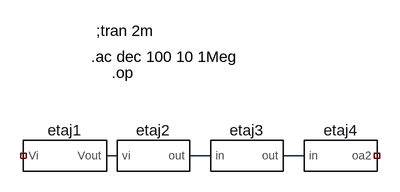
[diagram p0: schematic proiect.asc]
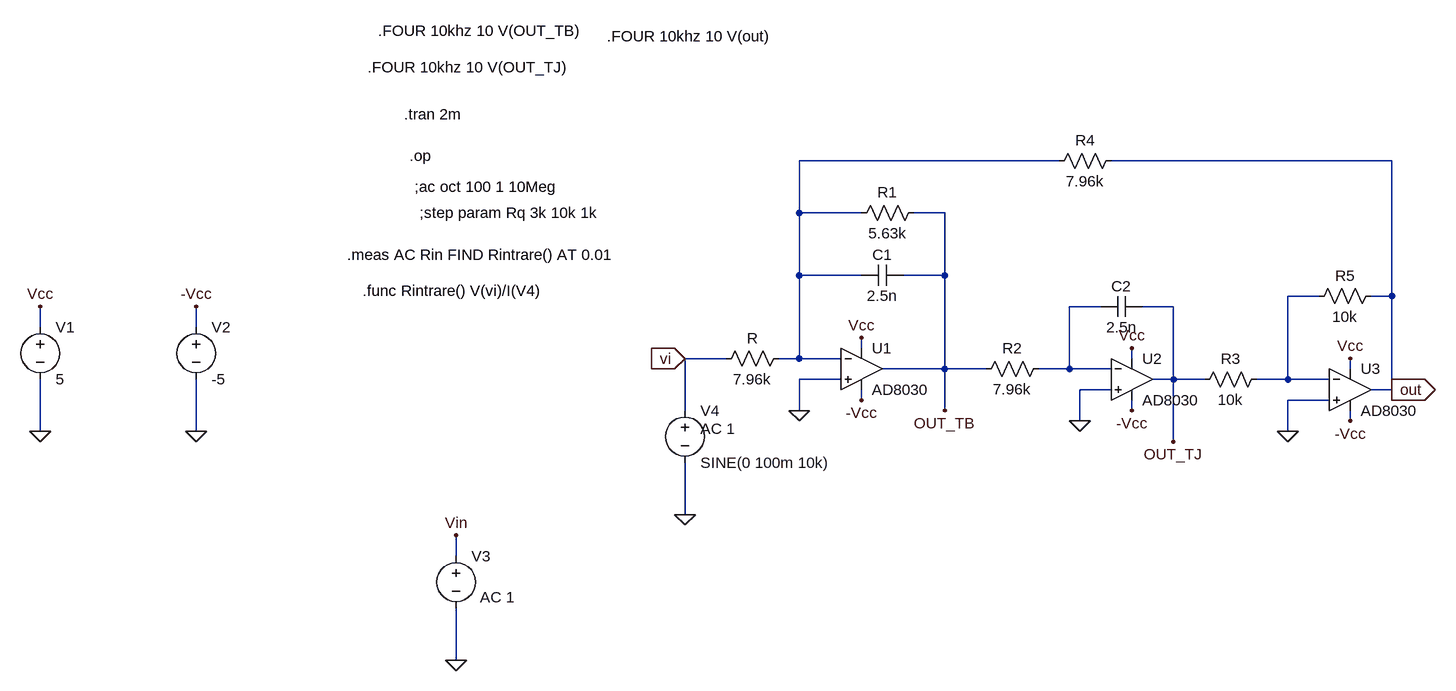
[diagram p1: sub-circuit etaj2_.asc]
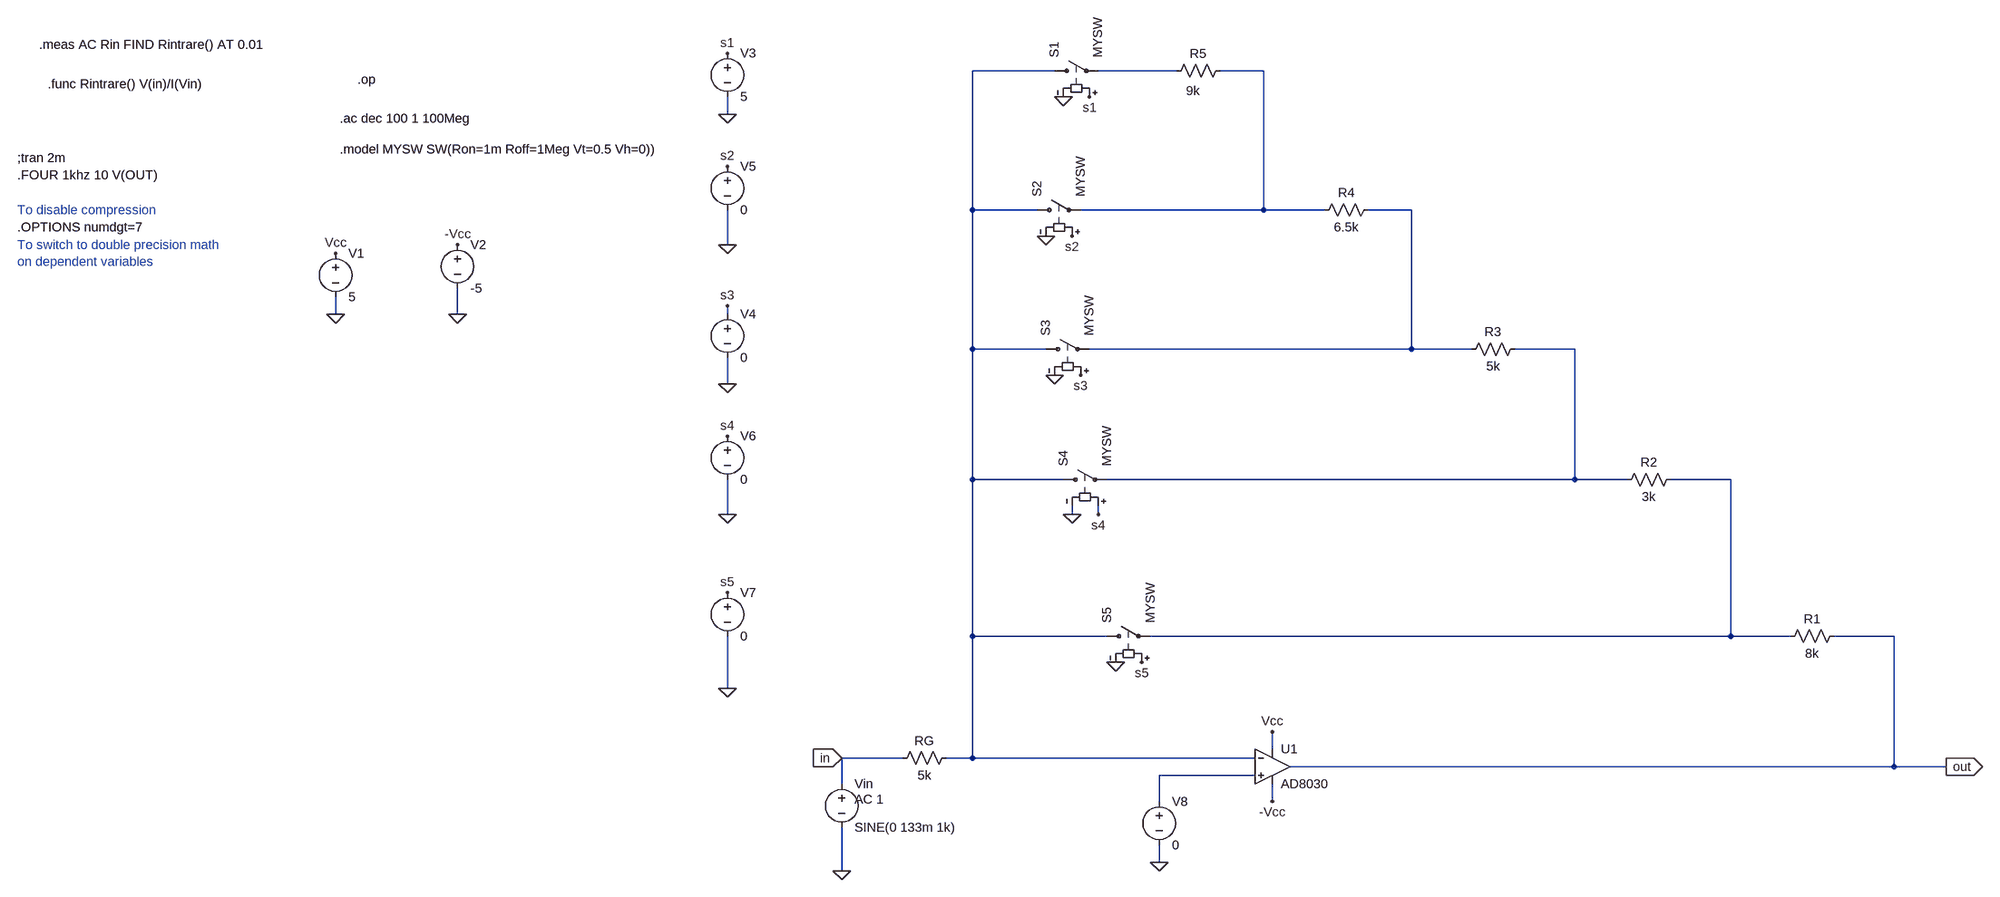
[diagram p2: sub-circuit etaj3_.asc]
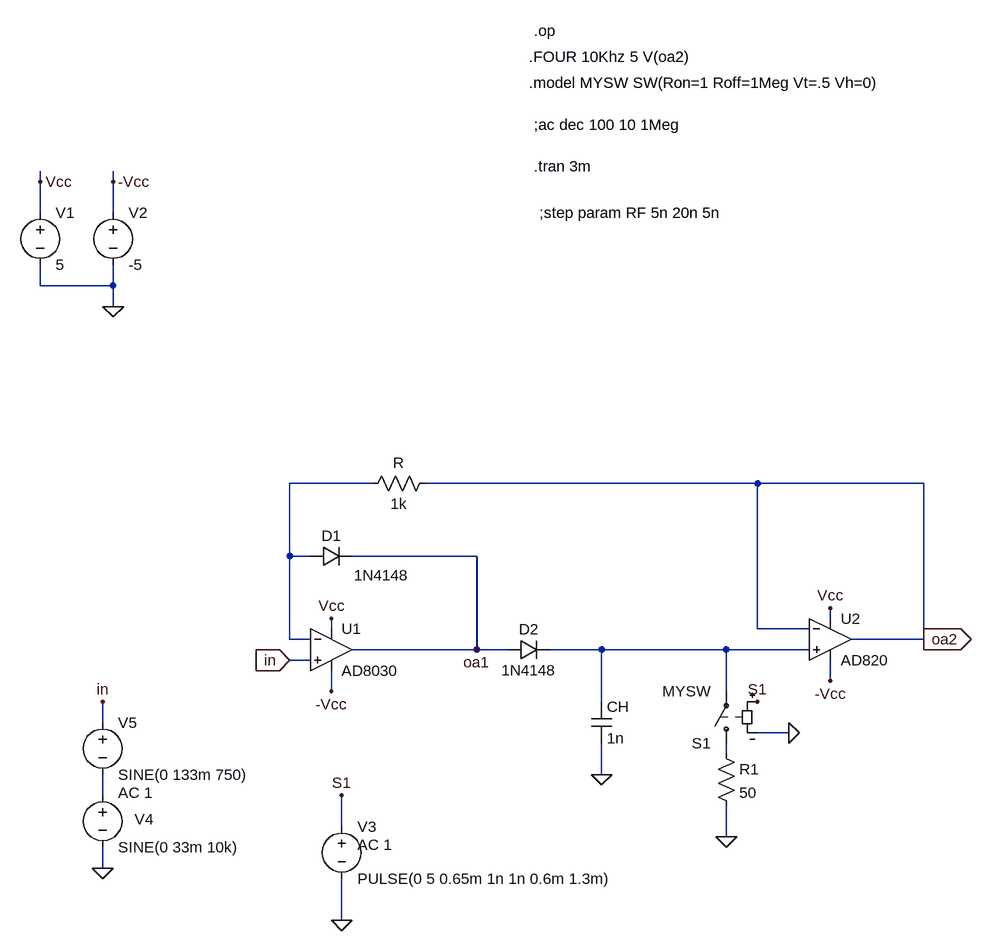
[diagram p3: sub-circuit etaj4_.asc]
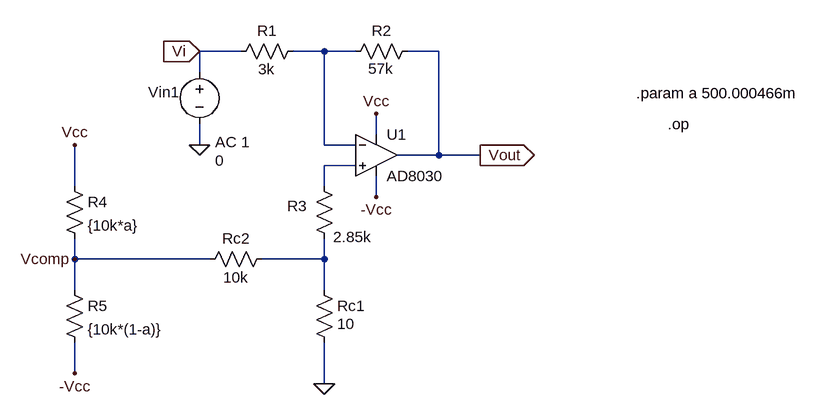
[diagram p4: sub-circuit etaj1.asc]
proiect.asc, the LTspice schematic file:
Version 4
SHEET 1 880 680
WIRE 112 160 96 160
WIRE 256 160 224 160
WIRE 400 160 368 160
SYMBOL etaj2_ 160 160 R0
SYMATTR InstName etaj2
SYMBOL etaj3_ 304 160 R0
SYMATTR InstName etaj3
SYMBOL etaj4_ 448 160 R0
SYMATTR InstName etaj4
SYMBOL ETAJ1 32 160 R0
SYMATTR InstName etaj1
TEXT 104 32 Left 2 !.op
TEXT 72 8 Left 2 !.ac dec 100 10 1Meg
TEXT 80 -32 Left 2 !;tran 2m

etaj2_.asc, the sub-circuit schematic file:
Version 4
SHEET 1 880 712
WIRE 208 -528 -192 -528
WIRE 720 -528 288 -528
WIRE -192 -448 -192 -528
WIRE -96 -448 -192 -448
WIRE 32 -448 -16 -448
WIRE -192 -352 -192 -448
WIRE -96 -352 -192 -352
WIRE 32 -352 32 -448
WIRE 32 -352 -32 -352
WIRE 608 -320 560 -320
WIRE 720 -320 720 -528
WIRE 720 -320 688 -320
WIRE 272 -304 224 -304
WIRE 384 -304 336 -304
WIRE -1360 -272 -1360 -304
WIRE -1120 -272 -1120 -304
WIRE -96 -240 -96 -256
WIRE -304 -224 -368 -224
WIRE -192 -224 -192 -352
WIRE -192 -224 -224 -224
WIRE -128 -224 -192 -224
WIRE 320 -224 320 -240
WIRE 32 -208 32 -352
WIRE 32 -208 -64 -208
WIRE 96 -208 32 -208
WIRE 224 -208 224 -304
WIRE 224 -208 176 -208
WIRE 288 -208 224 -208
WIRE 656 -208 656 -224
WIRE -128 -192 -192 -192
WIRE 384 -192 384 -304
WIRE 384 -192 352 -192
WIRE 432 -192 384 -192
WIRE 560 -192 560 -320
WIRE 560 -192 512 -192
WIRE 624 -192 560 -192
WIRE 288 -176 240 -176
WIRE 720 -176 720 -320
WIRE 720 -176 688 -176
WIRE -96 -160 -96 -176
WIRE 624 -160 560 -160
WIRE -368 -144 -368 -224
WIRE -192 -144 -192 -192
WIRE 32 -144 32 -208
WIRE 320 -144 320 -160
WIRE 240 -128 240 -176
WIRE 656 -128 656 -144
WIRE -1360 -112 -1360 -192
WIRE -1120 -112 -1120 -192
WIRE 560 -112 560 -160
WIRE 384 -96 384 -192
WIRE -368 16 -368 -64
WIRE -720 80 -720 48
WIRE -720 240 -720 160
FLAG -192 -144 0
FLAG 240 -128 0
FLAG 560 -112 0
FLAG -96 -256 Vcc
FLAG 320 -240 Vcc
FLAG 656 -224 Vcc
FLAG -96 -160 -Vcc
FLAG 320 -144 -Vcc
FLAG 656 -128 -Vcc
FLAG -720 48 Vin
FLAG 32 -144 OUT_TB
FLAG 384 -96 OUT_TJ
FLAG -1360 -304 Vcc
FLAG -1120 -304 -Vcc
FLAG -1360 -112 0
FLAG -1120 -112 0
FLAG 720 -176 out
IOPIN 720 -176 Out
FLAG -720 240 0
FLAG -368 16 0
FLAG -368 -224 vi
IOPIN -368 -224 In
SYMBOL OpAmps\\AD8030 -96 -272 R0
SYMATTR InstName U1
SYMBOL OpAmps\\AD8030 320 -256 R0
SYMATTR InstName U2
SYMBOL OpAmps\\AD8030 656 -240 R0
SYMATTR InstName U3
SYMBOL res -208 -240 R90
WINDOW 0 0 56 VBottom 2
WINDOW 3 32 56 VTop 2
SYMATTR InstName R
SYMATTR Value 7.96k
SYMBOL res 192 -224 R90
WINDOW 0 0 56 VBottom 2
WINDOW 3 32 56 VTop 2
SYMATTR InstName R2
SYMATTR Value 7.96k
SYMBOL res 528 -208 R90
WINDOW 0 0 56 VBottom 2
WINDOW 3 32 56 VTop 2
SYMATTR InstName R3
SYMATTR Value 10k
SYMBOL res 304 -544 R90
WINDOW 0 0 56 VBottom 2
WINDOW 3 32 56 VTop 2
SYMATTR InstName R4
SYMATTR Value 7.96k
SYMBOL res 0 -464 R90
WINDOW 0 0 56 VBottom 2
WINDOW 3 32 56 VTop 2
SYMATTR InstName R1
SYMATTR Value 5.63k
SYMBOL cap -96 -336 R270
WINDOW 0 32 32 VTop 2
WINDOW 3 0 32 VBottom 2
SYMATTR InstName C1
SYMATTR Value 2.5n
SYMBOL cap 272 -288 R270
WINDOW 0 32 32 VTop 2
WINDOW 3 0 32 VBottom 2
SYMATTR InstName C2
SYMATTR Value 2.5n
SYMBOL res 704 -336 R90
WINDOW 0 0 56 VBottom 2
WINDOW 3 32 56 VTop 2
SYMATTR InstName R5
SYMATTR Value 10k
SYMBOL voltage -1360 -288 R0
SYMATTR InstName V1
SYMATTR Value 5
SYMBOL voltage -1120 -288 R0
SYMATTR InstName V2
SYMATTR Value -5
SYMBOL voltage -720 64 R0
WINDOW 123 37 79 Left 2
WINDOW 39 0 0 Left 0
SYMATTR Value2 AC 1
SYMATTR InstName V3
SYMATTR Value ""
SYMBOL voltage -368 -160 R0
WINDOW 123 24 44 Left 2
WINDOW 39 0 0 Left 0
SYMATTR Value2 AC 1
SYMATTR InstName V4
SYMATTR Value SINE(0 100m 10k)
TEXT -792 -536 Left 2 !.op
TEXT -784 -488 Left 2 !;ac oct 100 1 10Meg
TEXT -776 -448 Left 2 !;step param Rq 3k 10k 1k
TEXT -800 -600 Left 2 !.tran 2m
TEXT -856 -672 Left 2 !.FOUR 10khz 10 V(OUT_TJ)
TEXT -840 -728 Left 2 !.FOUR 10khz 10 V(OUT_TB)
TEXT -488 -720 Left 2 !.FOUR 10khz 10 V(out)
TEXT -888 -384 Left 2 !.meas AC Rin FIND Rintrare() AT 0.01
TEXT -864 -328 Left 2 !.func Rintrare() V(vi)/I(V4)

etaj3_.asc, the sub-circuit schematic file:
Version 4
SHEET 1 880 888
WIRE -1808 -5536 -2096 -5536
WIRE -1584 -5536 -1728 -5536
WIRE -1424 -5536 -1504 -5536
WIRE -2656 -5456 -2656 -5488
WIRE -2096 -5280 -2096 -5536
WIRE -1840 -5280 -2096 -5280
WIRE -1424 -5280 -1424 -5536
WIRE -1424 -5280 -1760 -5280
WIRE -1312 -5280 -1424 -5280
WIRE -1152 -5280 -1232 -5280
WIRE -2656 -5216 -2656 -5280
WIRE -3616 -5088 -3616 -5120
WIRE -3392 -5088 -3392 -5136
WIRE -2656 -5088 -2656 -5104
WIRE -2096 -5024 -2096 -5280
WIRE -1824 -5024 -2096 -5024
WIRE -1152 -5024 -1152 -5280
WIRE -1152 -5024 -1744 -5024
WIRE -1024 -5024 -1152 -5024
WIRE -832 -5024 -944 -5024
WIRE -2656 -4960 -2656 -5008
WIRE -2096 -4784 -2096 -5024
WIRE -1792 -4784 -2096 -4784
WIRE -832 -4784 -832 -5024
WIRE -832 -4784 -1712 -4784
WIRE -736 -4784 -832 -4784
WIRE -512 -4784 -656 -4784
WIRE -2656 -4720 -2656 -4784
WIRE -1776 -4720 -1776 -4736
WIRE -1728 -4720 -1728 -4736
WIRE -2096 -4496 -2096 -4784
WIRE -1712 -4496 -2096 -4496
WIRE -512 -4496 -512 -4784
WIRE -512 -4496 -1632 -4496
WIRE -336 -4496 -512 -4496
WIRE -96 -4496 -256 -4496
WIRE -2656 -4400 -2656 -4496
WIRE -1408 -4288 -1408 -4320
WIRE -2224 -4272 -2336 -4272
WIRE -2096 -4272 -2096 -4496
WIRE -2096 -4272 -2144 -4272
WIRE -1440 -4272 -2096 -4272
WIRE -96 -4256 -96 -4496
WIRE -96 -4256 -1376 -4256
WIRE 0 -4256 -96 -4256
WIRE -1440 -4240 -1616 -4240
WIRE -2336 -4224 -2336 -4272
WIRE -1616 -4192 -1616 -4240
WIRE -1408 -4192 -1408 -4224
WIRE -1616 -4080 -1616 -4112
WIRE -2336 -4064 -2336 -4144
FLAG -2336 -4064 0
FLAG -3616 -5088 0
FLAG -3392 -5088 0
FLAG -3392 -5216 -Vcc
FLAG -3616 -5200 Vcc
FLAG -2656 -5456 0
FLAG -2656 -4720 0
FLAG -2656 -4400 0
FLAG -2656 -5216 0
FLAG -2656 -5568 s1
FLAG -2656 -5360 s2
FLAG -2656 -5104 s3
FLAG -2656 -4864 s4
FLAG -2656 -4576 s5
FLAG -2656 -4960 0
FLAG -1792 -5488 0
FLAG -1744 -5488 s1
FLAG -1824 -5232 0
FLAG -1776 -5232 s2
FLAG -1808 -4976 0
FLAG -1760 -4976 s3
FLAG -1776 -4720 0
FLAG -1728 -4720 s4
FLAG -1696 -4448 0
FLAG -1648 -4448 s5
FLAG 0 -4256 out
IOPIN 0 -4256 Out
FLAG -1408 -4320 Vcc
FLAG -1408 -4192 -Vcc
FLAG -2336 -4272 in
IOPIN -2336 -4272 In
FLAG -1616 -4080 0
SYMBOL res -1488 -5552 R90
WINDOW 0 0 56 VBottom 2
WINDOW 3 37 66 VTop 2
SYMATTR InstName R5
SYMATTR Value 9k
SYMBOL res -1216 -5296 R90
WINDOW 0 0 56 VBottom 2
WINDOW 3 32 56 VTop 2
SYMATTR InstName R4
SYMATTR Value 6.5k
SYMBOL res -928 -5040 R90
WINDOW 0 0 56 VBottom 2
WINDOW 3 32 56 VTop 2
SYMATTR InstName R3
SYMATTR Value 5k
SYMBOL res -640 -4800 R90
WINDOW 0 0 56 VBottom 2
WINDOW 3 32 56 VTop 2
SYMATTR InstName R2
SYMATTR Value 3k
SYMBOL res -240 -4512 R90
WINDOW 0 0 56 VBottom 2
WINDOW 3 32 56 VTop 2
SYMATTR InstName R1
SYMATTR Value 8k
SYMBOL res -2128 -4288 R90
WINDOW 0 0 56 VBottom 2
WINDOW 3 32 56 VTop 2
SYMATTR InstName RG
SYMATTR Value 5k
SYMBOL voltage -2336 -4240 R0
WINDOW 123 24 44 Left 2
WINDOW 39 0 0 Left 0
SYMATTR Value2 AC 1
SYMATTR InstName Vin
SYMATTR Value SINE(0 133m 1k)
SYMBOL voltage -3616 -5216 R0
WINDOW 123 0 0 Left 0
WINDOW 39 0 0 Left 0
SYMATTR InstName V1
SYMATTR Value 5
SYMBOL voltage -3392 -5232 R0
WINDOW 123 0 0 Left 0
WINDOW 39 0 0 Left 0
SYMATTR InstName V2
SYMATTR Value -5
SYMBOL voltage -2656 -5584 R0
WINDOW 123 0 0 Left 0
WINDOW 39 0 0 Left 0
SYMATTR InstName V3
SYMATTR Value 5
SYMBOL voltage -2656 -5104 R0
WINDOW 123 0 0 Left 0
WINDOW 39 0 0 Left 0
SYMATTR InstName V4
SYMATTR Value 0
SYMBOL voltage -2656 -5376 R0
WINDOW 123 0 0 Left 0
WINDOW 39 0 0 Left 0
SYMATTR InstName V5
SYMATTR Value 0
SYMBOL voltage -2656 -4880 R0
WINDOW 123 0 0 Left 0
WINDOW 39 0 0 Left 0
SYMATTR InstName V6
SYMATTR Value 0
SYMBOL voltage -2656 -4592 R0
WINDOW 123 0 0 Left 0
WINDOW 39 0 0 Left 0
SYMATTR InstName V7
SYMATTR Value 0
SYMBOL sw -1824 -5536 R270
SYMATTR InstName S1
SYMATTR Value MYSW
SYMBOL sw -1856 -5280 R270
SYMATTR InstName S2
SYMATTR Value MYSW
SYMBOL sw -1840 -5024 R270
SYMATTR InstName S3
SYMATTR Value MYSW
SYMBOL sw -1808 -4784 R270
SYMATTR InstName S4
SYMATTR Value MYSW
SYMBOL sw -1728 -4496 R270
SYMATTR InstName S5
SYMATTR Value MYSW
SYMBOL OpAmps\\AD8030 -1408 -4320 R0
SYMATTR InstName U1
SYMBOL voltage -1616 -4208 R0
WINDOW 123 0 0 Left 0
WINDOW 39 0 0 Left 0
SYMATTR InstName V8
SYMATTR Value 0
TEXT -3608 -5448 Left 2 !.ac dec 100 1 100Meg
TEXT -3608 -5392 Left 2 !.model MYSW SW(Ron=1m Roff=1Meg Vt=0.5 Vh=0))
TEXT -3576 -5520 Left 2 !.op
TEXT -5024 -5584 Left 2 !.meas AC Rin FIND Rintrare() AT 0.01
TEXT -5008 -5512 Left 2 !.func Rintrare() V(in)/I(Vin)
TEXT -5064 -5376 Left 2 !;tran 2m
TEXT -5064 -5280 Left 2 ;To disable compression
TEXT -5064 -5248 Left 2 !.OPTIONS numdgt=7
TEXT -5064 -5216 Left 2 ;To switch to double precision math\non dependent variables
TEXT -5064 -5344 Left 2 !.FOUR 1khz 10 V(OUT)

etaj4_.asc, the sub-circuit schematic file:
Version 4
SHEET 1 880 680
WIRE -736 -560 -736 -576
WIRE -624 -560 -624 -576
WIRE -736 -512 -736 -560
WIRE -624 -512 -624 -560
WIRE -736 -400 -736 -432
WIRE -624 -400 -624 -432
WIRE -624 -400 -736 -400
WIRE -624 -368 -624 -400
WIRE -224 -96 -352 -96
WIRE 368 -96 -144 -96
WIRE 624 -96 368 -96
WIRE -352 16 -352 -96
WIRE -320 16 -352 16
WIRE -64 16 -256 16
WIRE 480 112 480 96
WIRE -288 128 -288 112
WIRE 368 128 368 -96
WIRE 448 128 368 128
WIRE -352 144 -352 16
WIRE -320 144 -352 144
WIRE 624 144 624 -96
WIRE 624 144 512 144
WIRE -64 160 -64 16
WIRE -64 160 -256 160
WIRE -16 160 -64 160
WIRE 128 160 48 160
WIRE 320 160 128 160
WIRE 448 160 320 160
WIRE -320 176 -352 176
WIRE 480 208 480 176
WIRE -288 224 -288 192
WIRE 320 224 320 160
WIRE 128 240 128 160
WIRE -640 272 -640 240
WIRE 416 288 368 288
WIRE 320 320 320 304
WIRE 128 352 128 304
WIRE -640 384 -640 352
WIRE -272 432 -272 384
WIRE 320 448 320 400
WIRE -640 496 -640 464
WIRE -272 576 -272 512
FLAG -288 112 Vcc
FLAG -288 224 -Vcc
FLAG 480 96 Vcc
FLAG 480 208 -Vcc
FLAG 128 352 0
FLAG 624 144 oa2
IOPIN 624 144 Out
FLAG -624 -368 0
FLAG -736 -560 Vcc
FLAG -624 -560 -Vcc
FLAG -64 160 oa1
FLAG -640 496 0
FLAG -352 176 in
IOPIN -352 176 In
FLAG 320 448 0
FLAG 416 288 0
FLAG 368 240 S1
FLAG -272 384 S1
FLAG -272 576 0
FLAG -640 240 in
SYMBOL diode -320 32 R270
WINDOW 0 32 32 VTop 2
WINDOW 3 2 109 VBottom 2
SYMATTR InstName D1
SYMATTR Value 1N4148
SYMBOL diode -16 176 R270
WINDOW 0 32 32 VTop 2
WINDOW 3 0 32 VBottom 2
SYMATTR InstName D2
SYMATTR Value 1N4148
SYMBOL res -128 -112 R90
WINDOW 0 0 56 VBottom 2
WINDOW 3 32 56 VTop 2
SYMATTR InstName R
SYMATTR Value 1k
SYMBOL cap 112 240 R0
SYMATTR InstName CH
SYMATTR Value 1n
SYMBOL OpAmps\\AD8030 -288 96 R0
SYMATTR InstName U1
SYMBOL voltage -736 -528 R0
WINDOW 123 0 0 Left 2
WINDOW 39 0 0 Left 2
SYMATTR InstName V1
SYMATTR Value 5
SYMBOL voltage -624 -528 R0
WINDOW 123 0 0 Left 2
WINDOW 39 0 0 Left 2
SYMATTR InstName V2
SYMATTR Value -5
SYMBOL voltage -640 368 R0
WINDOW 123 0 0 Left 2
WINDOW 39 0 0 Left 2
WINDOW 0 49 53 Left 2
SYMATTR InstName V4
SYMATTR Value SINE(0 33m 10k)
SYMBOL voltage -640 256 R0
WINDOW 123 24 124 Left 2
WINDOW 39 0 0 Left 2
SYMATTR Value2 AC 1
SYMATTR InstName V5
SYMATTR Value SINE(0 133m 750)
SYMBOL OpAmps\\AD820 480 80 R0
SYMATTR InstName U2
SYMBOL sw 320 320 R180
SYMATTR InstName S1
SYMATTR Value MYSW
SYMBOL res 304 304 R0
SYMATTR InstName R1
SYMATTR Value 50
SYMBOL voltage -272 416 R0
WINDOW 123 24 44 Left 2
WINDOW 39 0 0 Left 0
SYMATTR Value2 AC 1
SYMATTR InstName V3
SYMATTR Value PULSE(0 5 0.65m 1n 1n 0.6m 1.3m)
TEXT 24 -792 Left 2 !.op
TEXT 24 -648 Left 2 !;ac dec 100 10 1Meg
TEXT 24 -584 Left 2 !.tran 3m
TEXT 16 -712 Left 2 !.model MYSW SW(Ron=1 Roff=1Meg Vt=.5 Vh=0)
TEXT 16 -752 Left 2 !.FOUR 10Khz 5 V(oa2)
TEXT 32 -512 Left 2 !;step param RF 5n 20n 5n

etaj1.asc, the sub-circuit schematic file:
Version 4
SHEET 1 960 680
WIRE 80 -160 16 -160
WIRE 208 -160 160 -160
WIRE 256 -160 208 -160
WIRE 384 -160 336 -160
WIRE 16 -128 16 -160
WIRE 288 -32 288 -64
WIRE 16 -16 16 -48
WIRE 208 -16 208 -160
WIRE 256 -16 208 -16
WIRE 384 0 384 -160
WIRE 384 0 320 0
WIRE 448 0 384 0
WIRE 256 16 208 16
WIRE -176 48 -176 -16
WIRE 208 48 208 16
WIRE 288 64 288 32
WIRE -176 160 -176 128
WIRE 32 160 -176 160
WIRE 208 160 208 128
WIRE 208 160 112 160
WIRE -176 208 -176 160
WIRE 208 208 208 160
WIRE -176 336 -176 288
WIRE 208 352 208 288
FLAG 208 352 0
FLAG 16 -16 0
FLAG 288 -64 Vcc
FLAG 288 64 -Vcc
FLAG -176 -16 Vcc
FLAG -176 336 -Vcc
FLAG 448 0 Vout
IOPIN 448 0 Out
FLAG -176 160 Vcomp
FLAG 16 -160 Vi
IOPIN 16 -160 In
SYMBOL OpAmps\\AD8030 288 -64 R0
SYMATTR InstName U1
SYMBOL res 176 -176 R90
WINDOW 0 0 56 VBottom 2
WINDOW 3 59 57 VBottom 2
SYMATTR InstName R1
SYMATTR Value 3k
SYMBOL res 352 -176 R90
WINDOW 0 0 56 VBottom 2
WINDOW 3 58 57 VBottom 2
SYMATTR InstName R2
SYMATTR Value 57k
SYMBOL res 192 32 R0
WINDOW 0 -41 46 Left 2
WINDOW 3 30 94 Left 2
SYMATTR InstName R3
SYMATTR Value 2.85k
SYMBOL res 192 192 R0
WINDOW 3 36 68 Left 2
SYMATTR Value 10
SYMATTR InstName Rc1
SYMBOL res 128 144 R90
WINDOW 0 0 56 VBottom 2
WINDOW 3 60 56 VBottom 2
SYMATTR InstName Rc2
SYMATTR Value 10k
SYMBOL voltage 16 -144 R0
WINDOW 0 -79 47 Left 2
WINDOW 3 24 152 Left 2
WINDOW 123 24 124 Left 2
WINDOW 39 0 0 Left 0
SYMATTR InstName Vin1
SYMATTR Value 0
SYMATTR Value2 AC 1
SYMBOL res -192 32 R0
SYMATTR InstName R4
SYMATTR Value {10k*a}
SYMBOL res -192 192 R0
SYMATTR InstName R5
SYMATTR Value {10k*(1-a)}
TEXT 688 -96 Left 2 !.param a 500.000466m
TEXT 736 -48 Left 2 !.op

The netlist it stands for:
* proiect.asc
Xetaj2 N001 N002 etaj2_
Xetaj3 N002 N003 etaj3_
Xetaj4 N003 NC_01 etaj4_
Xetaj1 NC_02 N001 etaj1

* block symbol definitions
.subckt etaj2_ vi out
XU1 0 N001 Vcc -Vcc OUT_TB AD8040  ; AD8030, pins In+ In- V+ V- OUT
XU2 0 N003 Vcc -Vcc OUT_TJ AD8040  ; AD8030, pins In+ In- V+ V- OUT
XU3 0 N002 Vcc -Vcc out AD8040  ; AD8030, pins In+ In- V+ V- OUT
R N001 vi 7.96k
R2 N003 OUT_TB 7.96k
R3 N002 OUT_TJ 10k
R4 out N001 7.96k
R1 OUT_TB N001 5.63k
C1 N001 OUT_TB 2.5n
C2 N003 OUT_TJ 2.5n
R5 out N002 10k
V1 Vcc 0 5
V2 -Vcc 0 -5
V3 Vin 0 AC 1
V4 vi 0 SINE(0 100m 10k) AC 1
.op
;ac oct 100 1 10Meg
;step param Rq 3k 10k 1k
.tran 2m
.FOUR 10khz 10 V(OUT_TJ)
.FOUR 10khz 10 V(OUT_TB)
.FOUR 10khz 10 V(out)
.meas AC Rin FIND Rintrare() AT 0.01
.func Rintrare() V(vi)/I(V4)
.ends etaj2_

.subckt etaj3_ in out
R5 N003 N002 9k
R4 N004 N003 6.5k
R3 N005 N004 5k
R2 N006 N005 3k
R1 out N006 8k
RG N001 in 5k
Vin in 0 SINE(0 133m 1k) AC 1
V1 Vcc 0 5
V2 -Vcc 0 -5
V3 s1 0 5
V4 s3 0 0
V5 s2 0 0
V6 s4 0 0
V7 s5 0 0
S1 N001 N002 s1 0 MYSW
S2 N001 N003 s2 0 MYSW
S3 N001 N004 s3 0 MYSW
S4 N001 N005 s4 0 MYSW
S5 N001 N006 s5 0 MYSW
XU1 N007 N001 Vcc -Vcc out AD8040  ; AD8030, pins In+ In- V+ V- OUT
V8 N007 0 0
.ac dec 100 1 100Meg
.model MYSW SW(Ron=1m Roff=1Meg Vt=0.5 Vh=0))
.op
.meas AC Rin FIND Rintrare() AT 0.01
.func Rintrare() V(in)/I(Vin)
;tran 2m
* To disable compression
.OPTIONS numdgt=7
* To switch to double precision math
* on dependent variables
.FOUR 1khz 10 V(OUT)
.ends etaj3_

.subckt etaj4_ in oa2
D1 N001 oa1 1N4148
D2 oa1 N002 1N4148
R oa2 N001 1k
CH N002 0 1n
XU1 in N001 Vcc -Vcc oa1 AD8040  ; AD8030, pins In+ In- V+ V- OUT
V1 Vcc 0 5
V2 -Vcc 0 -5
V4 N004 0 SINE(0 33m 10k)
V5 in N004 SINE(0 133m 750) AC 1
XU2 N002 oa2 Vcc -Vcc oa2 AD820  ; pins In+ In- V+ V- OUT
S1 N003 N002 S1 0 MYSW
R1 N003 0 50
V3 S1 0 PULSE(0 5 0.65m 1n 1n 0.6m 1.3m) AC 1
.op
;ac dec 100 10 1Meg
.tran 3m
.model MYSW SW(Ron=1 Roff=1Meg Vt=.5 Vh=0)
.FOUR 10Khz 5 V(oa2)
;step param RF 5n 20n 5n
.ends etaj4_

.subckt etaj1 Vi Vout
XU1 N002 N001 Vcc -Vcc Vout AD8040  ; AD8030, pins In+ In- V+ V- OUT
R1 N001 Vi 3k
R2 Vout N001 57k
R3 N002 N003 2.85k
Rc1 N003 0 10
Rc2 N003 Vcomp 10k
Vin1 Vi 0 0 AC 1
R4 Vcc Vcomp {10k*a}
R5 Vcomp -Vcc {10k*(1-a)}
.param a 500.000466m
.op
.ends etaj1

.model D D
.lib standard.dio
.op
.ac dec 100 10 1Meg
;tran 2m
.lib ADI.lib
.backanno
.end